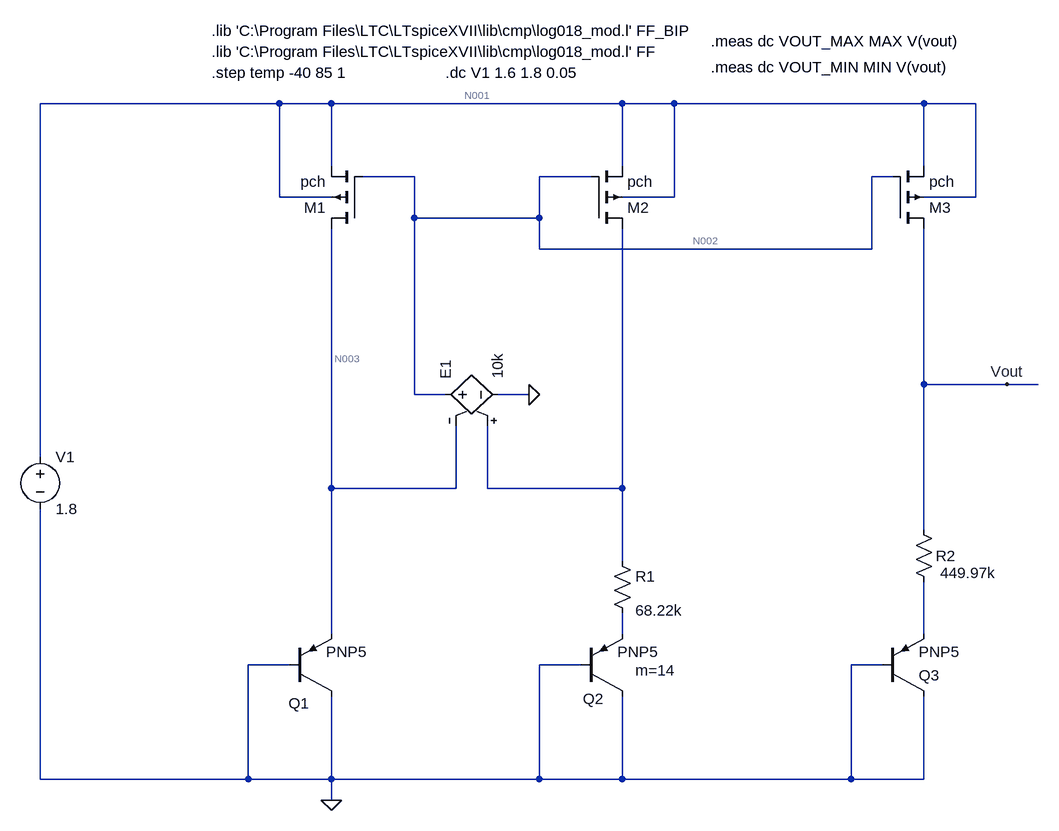
[diagram p0: schematic bandgap_c.asc]
bandgap_c.asc, the LTspice schematic file:
Version 4
SHEET 1 2496 1144
WIRE 320 -432 -48 -432
WIRE 400 -432 320 -432
WIRE 848 -432 400 -432
WIRE 928 -432 848 -432
WIRE 1312 -432 928 -432
WIRE 1392 -432 1312 -432
WIRE 400 -336 400 -432
WIRE 848 -336 848 -432
WIRE 1312 -336 1312 -432
WIRE 528 -320 448 -320
WIRE 800 -320 720 -320
WIRE 1264 -320 1232 -320
WIRE 320 -288 320 -432
WIRE 400 -288 320 -288
WIRE 928 -288 928 -432
WIRE 928 -288 848 -288
WIRE 1392 -288 1392 -432
WIRE 1392 -288 1312 -288
WIRE 528 -256 528 -320
WIRE 720 -256 720 -320
WIRE 720 -256 528 -256
WIRE 720 -208 720 -256
WIRE 1232 -208 1232 -320
WIRE 1232 -208 720 -208
WIRE 1312 0 1312 -240
WIRE 1440 0 1312 0
WIRE 1488 0 1440 0
WIRE 528 16 528 -256
WIRE 576 16 528 16
WIRE 704 16 656 16
WIRE -48 112 -48 -432
WIRE 400 160 400 -240
WIRE 592 160 592 64
WIRE 592 160 400 160
WIRE 640 160 640 64
WIRE 848 160 848 -240
WIRE 848 160 640 160
WIRE 1312 224 1312 0
WIRE 848 272 848 160
WIRE 400 384 400 160
WIRE 848 384 848 352
WIRE 1312 384 1312 304
WIRE 336 432 272 432
WIRE 784 432 720 432
WIRE 1248 432 1200 432
WIRE -48 608 -48 192
WIRE 272 608 272 432
WIRE 272 608 -48 608
WIRE 400 608 400 480
WIRE 400 608 272 608
WIRE 720 608 720 432
WIRE 720 608 400 608
WIRE 848 608 848 480
WIRE 848 608 720 608
WIRE 1200 608 1200 432
WIRE 1200 608 848 608
WIRE 1312 608 1312 480
WIRE 1312 608 1200 608
WIRE 400 640 400 608
FLAG 400 640 0
FLAG 704 16 0
FLAG 1440 0 Vout
SYMBOL pnp2 336 480 M180
WINDOW 0 -2 -11 Left 2
SYMATTR InstName Q1
SYMATTR Value PNP5
SYMBOL pnp2 784 480 M180
WINDOW 123 84 40 Left 2
WINDOW 0 3 -4 Left 2
SYMATTR Value2 m=14
SYMATTR InstName Q2
SYMATTR Value PNP5
SYMBOL voltage -48 96 R0
WINDOW 123 0 0 Left 0
WINDOW 39 0 0 Left 0
SYMATTR InstName V1
SYMATTR Value 1.8
SYMBOL pmos4 448 -240 R180
SYMATTR InstName M1
SYMATTR Value pch
SYMATTR Value2 l=7u w=20u
SYMBOL pmos4 800 -240 M180
SYMATTR InstName M2
SYMATTR Value pch
SYMATTR Value2 l=7u w=20u
SYMBOL e2 560 16 R270
SYMATTR InstName E1
SYMATTR Value 10k
SYMBOL res 832 256 R0
WINDOW 3 36 92 Left 2
SYMATTR Value 68.22k
SYMATTR InstName R1
SYMBOL pmos4 1264 -240 M180
SYMATTR InstName M3
SYMATTR Value pch
SYMATTR Value2 l=7u w=20u
SYMBOL res 1296 208 R0
WINDOW 0 34 56 Left 2
WINDOW 3 41 82 Left 2
SYMATTR InstName R2
SYMATTR Value 449.97k
SYMBOL pnp2 1248 480 M180
SYMATTR InstName Q3
SYMATTR Value PNP5
TEXT 216 -480 Left 2 !.step temp -40 85 1
TEXT 216 -512 Left 2 !.lib 'C:\\Program Files\\LTC\\LTspiceXVII\\lib\\cmp\\log018_mod.l' FF
TEXT 216 -544 Left 2 !.lib 'C:\\Program Files\\LTC\\LTspiceXVII\\lib\\cmp\\log018_mod.l' FF_BIP
TEXT 576 -480 Left 2 !.dc V1 1.6 1.8 0.05
TEXT 984 -528 Left 2 !.meas dc VOUT_MAX MAX V(vout)
TEXT 984 -488 Left 2 !.meas dc VOUT_MIN MIN V(vout)

The netlist it stands for:
* bandgap_c.asc
Q1 0 0 N003 0 PNP5
Q2 0 0 N005 0 PNP5 m=14
V1 N001 0 1.8
M1 N003 N002 N001 N001 pch l=7u w=20u
M2 N004 N002 N001 N001 pch l=7u w=20u
E1 N002 0 N004 N003 10k
R1 N004 N005 68.22k
M3 Vout N002 N001 N001 pch l=7u w=20u
R2 Vout N006 449.97k
Q3 0 0 N006 0 PNP5
.model NPN NPN
.model PNP PNP
.lib standard.bjt
.model NMOS NMOS
.model PMOS PMOS
.lib standard.mos
.step temp -40 85 1
.lib 'C:\Program Files\LTC\LTspiceXVII\lib\cmp\log018_mod.l' FF
.lib 'C:\Program Files\LTC\LTspiceXVII\lib\cmp\log018_mod.l' FF_BIP
.dc V1 1.6 1.8 0.05
.meas dc VOUT_MAX MAX V(vout)
.meas dc VOUT_MIN MIN V(vout)
.backanno
.end

* Results of the author's LTspice run, read from the files saved beside the schematic
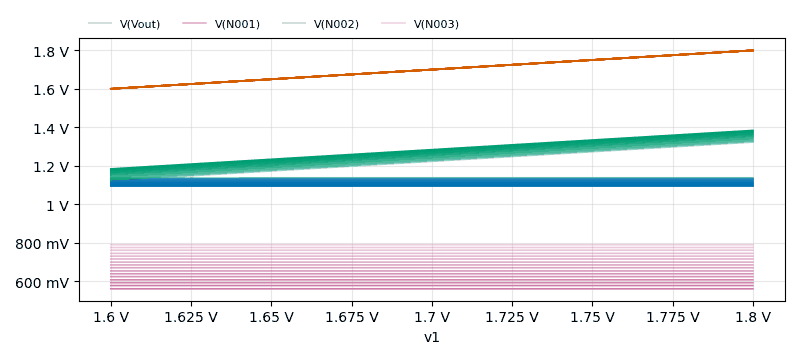
[diagram p1: DC transfer characteristic of bandgap_c.asc, plotted from the saved traces]
* DC transfer characteristic, 126 runs:
*   V(Vout) [run 1]: 1.137 V at v1=1.6 V, 1.138 V at v1=1.8 V, min 1.137 V, max 1.138 V
*   V(Vout) [run 2]: 1.135 V at v1=1.6 V, 1.135 V at v1=1.8 V, min 1.135 V, max 1.135 V
*   V(Vout) [run 3]: 1.132 V at v1=1.6 V, 1.133 V at v1=1.8 V, min 1.132 V, max 1.133 V
*   V(Vout) [run 4]: 1.129 V at v1=1.6 V, 1.13 V at v1=1.8 V, min 1.129 V, max 1.13 V
*   V(Vout) [run 5]: 1.127 V at v1=1.6 V, 1.127 V at v1=1.8 V, min 1.127 V, max 1.127 V
*   V(Vout) [run 6]: 1.124 V at v1=1.6 V, 1.124 V at v1=1.8 V, min 1.124 V, max 1.124 V
*   V(Vout) [run 7]: 1.121 V at v1=1.6 V, 1.121 V at v1=1.8 V, min 1.121 V, max 1.121 V
*   V(Vout) [run 8]: 1.118 V at v1=1.6 V, 1.119 V at v1=1.8 V, min 1.118 V, max 1.119 V
*   V(N001) [run 1]: 1.6 V at v1=1.6 V, 1.8 V at v1=1.8 V, min 1.6 V, max 1.8 V
*   V(N001) [run 2]: 1.6 V at v1=1.6 V, 1.8 V at v1=1.8 V, min 1.6 V, max 1.8 V
*   V(N001) [run 3]: 1.6 V at v1=1.6 V, 1.8 V at v1=1.8 V, min 1.6 V, max 1.8 V
*   V(N001) [run 4]: 1.6 V at v1=1.6 V, 1.8 V at v1=1.8 V, min 1.6 V, max 1.8 V
*   V(N001) [run 5]: 1.6 V at v1=1.6 V, 1.8 V at v1=1.8 V, min 1.6 V, max 1.8 V
*   V(N001) [run 6]: 1.6 V at v1=1.6 V, 1.8 V at v1=1.8 V, min 1.6 V, max 1.8 V
*   V(N001) [run 7]: 1.6 V at v1=1.6 V, 1.8 V at v1=1.8 V, min 1.6 V, max 1.8 V
*   V(N001) [run 8]: 1.6 V at v1=1.6 V, 1.8 V at v1=1.8 V, min 1.6 V, max 1.8 V
*   V(N002) [run 1]: 1.123 V at v1=1.6 V, 1.323 V at v1=1.8 V, min 1.123 V, max 1.323 V
*   V(N002) [run 2]: 1.127 V at v1=1.6 V, 1.327 V at v1=1.8 V, min 1.127 V, max 1.327 V
*   V(N002) [run 3]: 1.131 V at v1=1.6 V, 1.331 V at v1=1.8 V, min 1.131 V, max 1.331 V
*   V(N002) [run 4]: 1.136 V at v1=1.6 V, 1.336 V at v1=1.8 V, min 1.136 V, max 1.336 V
*   V(N002) [run 5]: 1.14 V at v1=1.6 V, 1.34 V at v1=1.8 V, min 1.14 V, max 1.34 V
*   V(N002) [run 6]: 1.144 V at v1=1.6 V, 1.344 V at v1=1.8 V, min 1.144 V, max 1.344 V
*   V(N002) [run 7]: 1.149 V at v1=1.6 V, 1.349 V at v1=1.8 V, min 1.149 V, max 1.349 V
*   V(N002) [run 8]: 1.153 V at v1=1.6 V, 1.353 V at v1=1.8 V, min 1.153 V, max 1.353 V
*   V(N003) [run 1]: 789.4 mV at v1=1.6 V, 789.4 mV at v1=1.8 V, min 789.4 mV, max 789.4 mV
*   V(N003) [run 2]: 775.1 mV at v1=1.6 V, 775.1 mV at v1=1.8 V, min 775.1 mV, max 775.1 mV
*   V(N003) [run 3]: 760.6 mV at v1=1.6 V, 760.6 mV at v1=1.8 V, min 760.6 mV, max 760.6 mV
*   V(N003) [run 4]: 744.3 mV at v1=1.6 V, 744.3 mV at v1=1.8 V, min 744.3 mV, max 744.3 mV
*   V(N003) [run 5]: 729.8 mV at v1=1.6 V, 729.8 mV at v1=1.8 V, min 729.8 mV, max 729.8 mV
*   V(N003) [run 6]: 715.3 mV at v1=1.6 V, 715.3 mV at v1=1.8 V, min 715.3 mV, max 715.3 mV
*   V(N003) [run 7]: 698.8 mV at v1=1.6 V, 698.8 mV at v1=1.8 V, min 698.8 mV, max 698.8 mV
*   V(N003) [run 8]: 684.2 mV at v1=1.6 V, 684.2 mV at v1=1.8 V, min 684.2 mV, max 684.2 mV
* From the log:
*   Measurement: vout_max
*     step  MAX(v(vout))  FROM  TO
*        1  1.13752  1.6  1.8
*        2  1.13722  1.6  1.8
*        3  1.13691  1.6  1.8
*        4  1.1366  1.6  1.8
*        5  1.1363  1.6  1.8
*        6  1.13599  1.6  1.8
*        7  1.13568  1.6  1.8
*        8  1.13537  1.6  1.8
*        9  1.13506  1.6  1.8
*       10  1.13475  1.6  1.8
*       11  1.13444  1.6  1.8
*       12  1.13412  1.6  1.8
*       13  1.13381  1.6  1.8
*       14  1.1335  1.6  1.8
*       15  1.13318  1.6  1.8
*       16  1.13287  1.6  1.8
*       17  1.13255  1.6  1.8
*       18  1.13223  1.6  1.8
*       19  1.13192  1.6  1.8
*       20  1.1316  1.6  1.8
*       21  1.13128  1.6  1.8
*       22  1.13096  1.6  1.8
*       23  1.13064  1.6  1.8
*       24  1.13032  1.6  1.8
*       25  1.13  1.6  1.8
*       26  1.12968  1.6  1.8
*       27  1.12935  1.6  1.8
*       28  1.12903  1.6  1.8
*       29  1.12871  1.6  1.8
*       30  1.12838  1.6  1.8
*       31  1.12805  1.6  1.8
*       32  1.12773  1.6  1.8
*       33  1.1274  1.6  1.8
*       34  1.12707  1.6  1.8
*       35  1.12675  1.6  1.8
*       36  1.12642  1.6  1.8
*       37  1.12609  1.6  1.8
*       38  1.12576  1.6  1.8
*       39  1.12543  1.6  1.8
*       40  1.1251  1.6  1.8
*     ...
*   Measurement: vout_min
*     step  MIN(v(vout))  FROM  TO
*        1  1.13726  1.6  1.8
*        2  1.13695  1.6  1.8
*        3  1.13665  1.6  1.8
*        4  1.13634  1.6  1.8
*        5  1.13603  1.6  1.8
*        6  1.13572  1.6  1.8
*        7  1.13541  1.6  1.8
*        8  1.1351  1.6  1.8
*        9  1.13479  1.6  1.8
*       10  1.13448  1.6  1.8
*       11  1.13417  1.6  1.8
*       12  1.13385  1.6  1.8
*       13  1.13354  1.6  1.8
*       14  1.13322  1.6  1.8
*       15  1.13291  1.6  1.8
*       16  1.13259  1.6  1.8
*       17  1.13228  1.6  1.8
*       18  1.13196  1.6  1.8
*       19  1.13164  1.6  1.8
*       20  1.13132  1.6  1.8
*       21  1.131  1.6  1.8
*       22  1.13068  1.6  1.8
*       23  1.13036  1.6  1.8
*       24  1.13004  1.6  1.8
*       25  1.12972  1.6  1.8
*       26  1.12939  1.6  1.8
*       27  1.12907  1.6  1.8
*       28  1.12875  1.6  1.8
*       29  1.12842  1.6  1.8
*       30  1.1281  1.6  1.8
*       31  1.12777  1.6  1.8
*       32  1.12744  1.6  1.8
*       33  1.12712  1.6  1.8
*       34  1.12679  1.6  1.8
*       35  1.12646  1.6  1.8
*       36  1.12613  1.6  1.8
*       37  1.1258  1.6  1.8
*       38  1.12547  1.6  1.8
*       39  1.12514  1.6  1.8
*       40  1.1248  1.6  1.8
*     ...